# EAGLE design AB2KController (EAGLE 7.3.0)
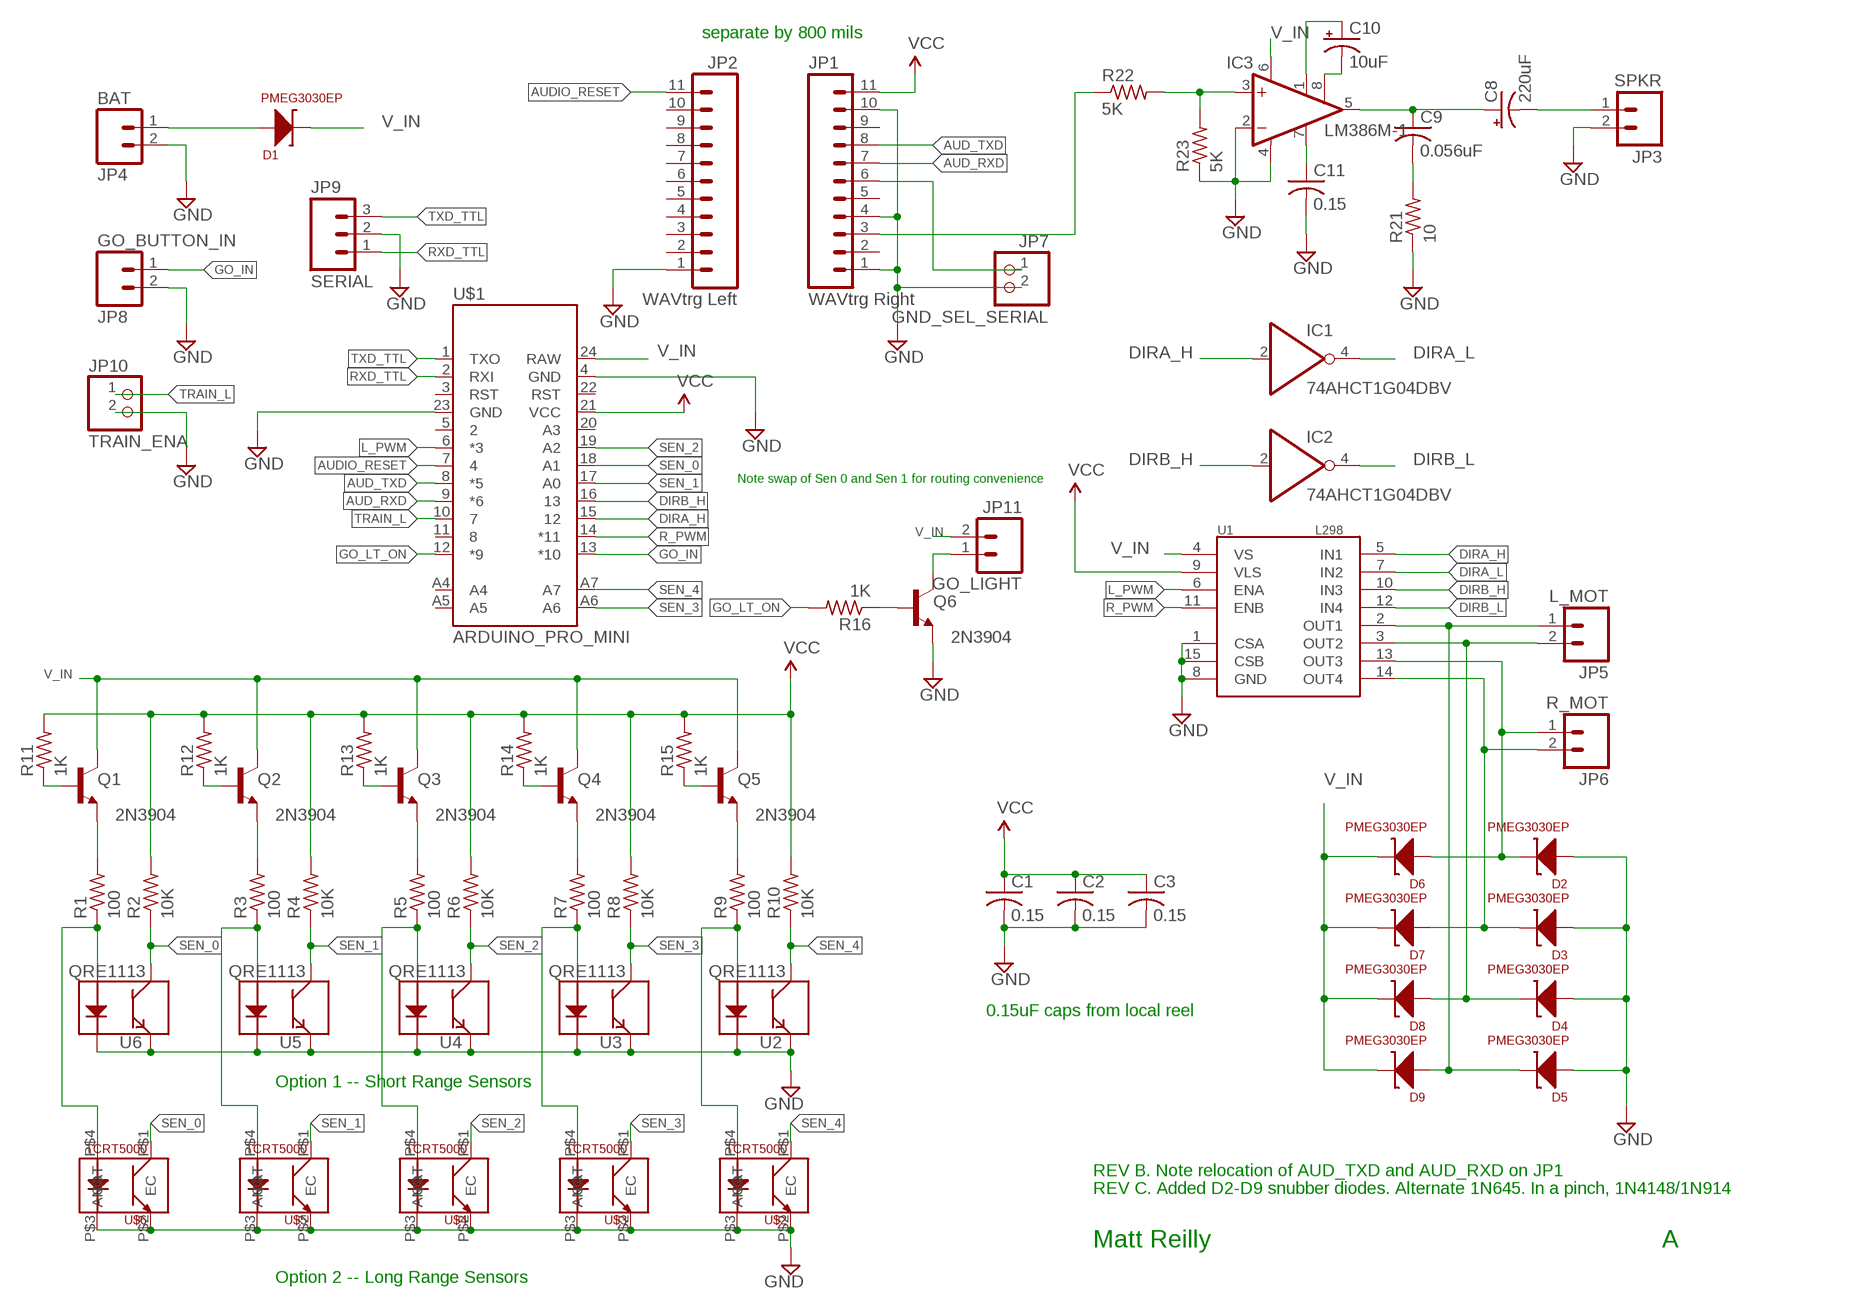
[diagram p0: schematic, sheet 1]

## Parts
C1  0.15  C-USC1206K  [C1206K]
C2  0.15  C-USC1206K  [C1206K]
C3  0.15  C-USC1206K  [C1206K]
C8  220uF  CPOL-USD/7343-31R  [D/7343-31R]
C9  0.056uF  C-USC1210  [C1210]
C10  10uF  CPOL-USD/7343-31R  [D/7343-31R]
C11  0.15  C-USC1206K  [C1206K]
D1  PMEG3030EP  [SOD128]
D2  PMEG3030EP  [SOD128]
D3  PMEG3030EP  [SOD128]
D4  PMEG3030EP  [SOD128]
D5  PMEG3030EP  [SOD128]
D6  PMEG3030EP  [SOD128]
D7  PMEG3030EP  [SOD128]
D8  PMEG3030EP  [SOD128]
D9  PMEG3030EP  [SOD128]
IC1  74AHCT1G04DBV  [SOT23-5]
IC2  74AHCT1G04DBV  [SOT23-5]
IC3  LM386M-1  [SO08]
JP1  WAVtrg Right  M11PTH  [1X11]
JP2  WAVtrg Left  M11PTH  [1X11]
JP3  SPKR  M025MM  [SCREWTERMINAL-5MM-2]
JP4  BAT  M025MM  [SCREWTERMINAL-5MM-2]
JP5  L_MOT  M025MM  [SCREWTERMINAL-5MM-2]
JP6  R_MOT  M025MM  [SCREWTERMINAL-5MM-2]
JP7  GND_SEL_SERIAL  PINHD-1X2  [1X02]
JP8  GO_BUTTON_IN  M025MM  [SCREWTERMINAL-5MM-2]
JP9  SERIAL  M03PTH  [1X03]
JP10  TRAIN_ENA  PINHD-1X2  [1X02]
JP11  GO_LIGHT  M025MM  [SCREWTERMINAL-5MM-2]
Q1  2N3904  [TO92]
Q2  2N3904  [TO92]
Q3  2N3904  [TO92]
Q4  2N3904  [TO92]
Q5  2N3904  [TO92]
Q6  2N3904  [TO92]
R1  100  R-US_M1206  [M1206]
R2  10K  R-US_M1206  [M1206]
R3  100  R-US_M1206  [M1206]
R4  10K  R-US_M1206  [M1206]
R5  100  R-US_M1206  [M1206]
R6  10K  R-US_M1206  [M1206]
R7  100  R-US_M1206  [M1206]
R8  10K  R-US_M1206  [M1206]
R9  100  R-US_M1206  [M1206]
R10  10K  R-US_M1206  [M1206]
R11  1K  R-US_M1206  [M1206]
R12  1K  R-US_M1206  [M1206]
R13  1K  R-US_M1206  [M1206]
R14  1K  R-US_M1206  [M1206]
R15  1K  R-US_M1206  [M1206]
R16  1K  R-US_M1206  [M1206]
R21  10  R-US_R1210  [R1210]
R22  5K  R-US_R1206  [R1206]
R23  5K  R-US_R1206  [R1206]
U1  L298  [MULTIWATT15]
U2  QRE1113  [QRE1113]
U3  QRE1113  [QRE1113]
U4  QRE1113  [QRE1113]
U5  QRE1113  [QRE1113]
U6  QRE1113  [QRE1113]
U$1  ARDUINO_PRO_MINI  [ARDUINO_PRO_MINI]
U$2  TCRT5000  [TCRT5000]
U$3  TCRT5000  [TCRT5000]
U$4  TCRT5000  [TCRT5000]
U$5  TCRT5000  [TCRT5000]
U$6  TCRT5000  [TCRT5000]

## Nets
AUD_RXD: JP1.7 U$1.9(*6)
AUD_TXD: JP1.8 U$1.8(*5)
AUDIO_RESET: JP2.11 U$1.7
DIRA_H: IC1.2(I) U1.5(IN1) U$1.15
DIRA_L: IC1.4(O) U1.7(IN2)
DIRB_H: IC2.2(I) U1.10(IN3) U$1.16
DIRB_L: IC2.4(O) U1.12(IN4)
GND: C1.2 C2.2 C3.2 C11.2 D2.P$1(A) D3.P$1(A) D4.P$1(A) D5.P$1(A) IC3.2(-IN) IC3.4(GND) JP1.1 JP1.4 JP1.10 JP2.1 JP3.2 JP4.2 JP7.2 JP8.2 JP9.2 JP10.2 Q6.3(E) R21.1 R23.1 U1.1(CSA) U1.8(GND) U1.15(CSB) U2.2(K) U2.4(E) U3.2(K) U3.4(E) U4.2(K) U4.4(E) U5.2(K) U5.4(E) U6.2(K) U6.4(E) U$1.4(GND) U$1.23(GND) U$2.P$2(E) U$2.P$3(CAT) U$3.P$2(E) U$3.P$3(CAT) U$4.P$2(E) U$4.P$3(CAT) U$5.P$2(E) U$5.P$3(CAT) U$6.P$2(E) U$6.P$3(CAT)
GO_IN: JP8.1 U$1.13(*10)
GO_LT_ON: R16.2 U$1.12(*9)
L_PWM: U1.6(ENA) U$1.6(*3)
N$1: D5.P$2(C) D9.P$1(A) JP5.1 U1.2(OUT1)
N$2: D4.P$2(C) D8.P$1(A) JP5.2 U1.3(OUT2)
N$3: D2.P$2(C) D6.P$1(A) JP6.1 U1.13(OUT3)
N$4: D3.P$2(C) D7.P$1(A) JP6.2 U1.14(OUT4)
N$5: D1.P$1(A) JP4.1
N$6: JP11.1 Q6.1(C)
N$7: R1.1 U6.1(A) U$6.P$4(ANO)
N$8: R3.1 U5.1(A) U$5.P$4(ANO)
N$9: Q1.3(E) R1.2
N$10: Q2.3(E) R3.2
N$11: R5.1 U4.1(A) U$4.P$4(ANO)
N$12: Q3.3(E) R5.2
N$13: R7.1 U3.1(A) U$3.P$4(ANO)
N$14: R9.1 U2.1(A) U$2.P$4(ANO)
N$15: Q1.2(B) R11.1
N$16: IC3.3(+IN) R22.2 R23.2
N$17: Q2.2(B) R12.1
N$18: C8.+ C9.1 IC3.5(OUT)
N$19: C8.- JP3.1
N$20: C10.- IC3.8(GAIN)
N$21: C9.2 R21.2
N$22: C10.+ IC3.1(GAIN)
N$23: C11.1 IC3.7(BYPASS)
N$24: Q3.2(B) R13.1
N$25: Q6.2(B) R16.1
N$26: Q4.2(B) R14.1
N$27: JP1.3 R22.1
N$28: JP1.6 JP7.1
N$29: Q5.2(B) R15.1
N$30: Q4.3(E) R7.2
N$31: Q5.3(E) R9.2
R_PWM: U1.11(ENB) U$1.14(*11)
RXD_TTL: JP9.1 U$1.2(RXI)
SEN_0: R2.1 U6.3(C) U$1.18(A1) U$6.P$1(C)
SEN_1: R4.1 U5.3(C) U$1.17(A0) U$5.P$1(C)
SEN_2: R6.1 U4.3(C) U$1.19(A2) U$4.P$1(C)
SEN_3: R8.1 U3.3(C) U$1.A6 U$3.P$1(C)
SEN_4: R10.1 U2.3(C) U$1.A7 U$2.P$1(C)
TRAIN_L: JP10.1 U$1.10
TXD_TTL: JP9.3 U$1.1(TXO)
V_IN: D1.P$2(C) D6.P$2(C) D7.P$2(C) D8.P$2(C) D9.P$2(C) IC3.6(VS) JP11.2 Q1.1(C) Q2.1(C) Q3.1(C) Q4.1(C) Q5.1(C) U1.4(VS) U$1.24(RAW)
VCC: C1.1 C2.1 C3.1 JP1.11 R2.2 R4.2 R6.2 R8.2 R10.2 R11.2 R12.2 R13.2 R14.2 R15.2 U1.9(VLS) U$1.21(VCC)
Unconnected: JP1.2 JP1.5 JP1.9 JP2.2 JP2.3 JP2.4 JP2.5 JP2.6 JP2.7 JP2.8 JP2.9 JP2.10 U$1.3(RST) U$1.5 U$1.11 U$1.20(A3) U$1.22(RST) U$1.A4 U$1.A5

## Notes on the sheet
- separate by 800 mils
- Note swap of Sen 0 and Sen 1 for routing convenience
- 0.15uF caps from local reel
- Option 1 -- Short Range Sensors
- REV B. Note relocation of AUD_TXD and AUD_RXD on JP1
- REV C. Added D2-D9 snubber diodes. Alternate 1N645. In a pinch, 1N4148/1N914
- Matt Reilly | A
- Option 2 -- Long Range Sensors

## Power pins joined to a net without a drawn wire
GND: IC1.3(GND) IC2.3(GND)
VCC: IC1.5(VCC) IC2.5(VCC)

## Library data of the parts
C1-C3 C11 = resistor:C-US: CAPACITOR, American symbol
C8 C10 = rcl:CPOL-US: POLARIZED CAPACITOR, American symbol
C9 = rcl:C-US: CAPACITOR, American symbol
D1-D9 = kb1vc_robot_parts:PMEG3030EP
IC1 IC2 = 74xx-little-de:74*1G04: INVERTER Gate
IC3 = linear:LM386?-*: Low Voltage Audio Power Amplifier Source: http://cache.national.com/ds/LM/LM386.pdf
JP1 JP2 = SparkFun-Connectors:M11: Header 11 Standard 11-pin 0.1" header. Use with straight break away headers (SKU : PRT-00116), right angle break away headers (PRT-00553), swiss pins (PRT-00743), machine pins (PRT-00117), and female headers (PRT-00115).
JP3-JP6 JP8 JP11 = SparkFun-Connectors:M02: Standard 2-pin 0.1" header. Use with - straight break away headers ( PRT-00116) - right angle break away headers (PRT-00553) - swiss pins (PRT-00743) - machine pins (PRT-00117) - female headers (PRT-00115) Molex polarized connector foot print use with: PRT-08233 with associated crimp pins and housings. 2.54_SCREWTERM for use with PRT-10571. 3.5mm Screw Terminal footprints for PRT-08084 5mm Screw Terminal footprints for use with PRT-08432; STOREFRONT_ID: PRT-08432
JP7 JP10 = pinhead:PINHD-1X2: PIN HEADER
JP9 = SparkFun-Connectors:M03: Header 3 Standard 3-pin 0.1" header. Use with straight break away headers (SKU : PRT-00116), right angle break away headers (PRT-00553), swiss pins (PRT-00743), machine pins (PRT-00117), and female headers (PRT-00115). Molex polarized connector foot print use with SKU : PRT-08232 with associated crimp pins and housings.
Q1-Q6 = transistor-npn:2N3904: NPN Transistor
R1-R16 = resistor:R-US_: RESISTOR, American symbol
R21-R23 = rcl:R-US_: RESISTOR, American symbol
U1 = SparkFun-PowerIC:L298: L298 Dual Full Bridge Driver
U2-U6 = SparkFun-Sensors:QRE1113: Reflective object sensor; PROD_ID: IC-09357
U$1 = kb1vc_Arduino_Parts:ARDUINO_PRO_MINI
U$2-U$6 = kb1vc_robot_parts:TCRT5000

## Board
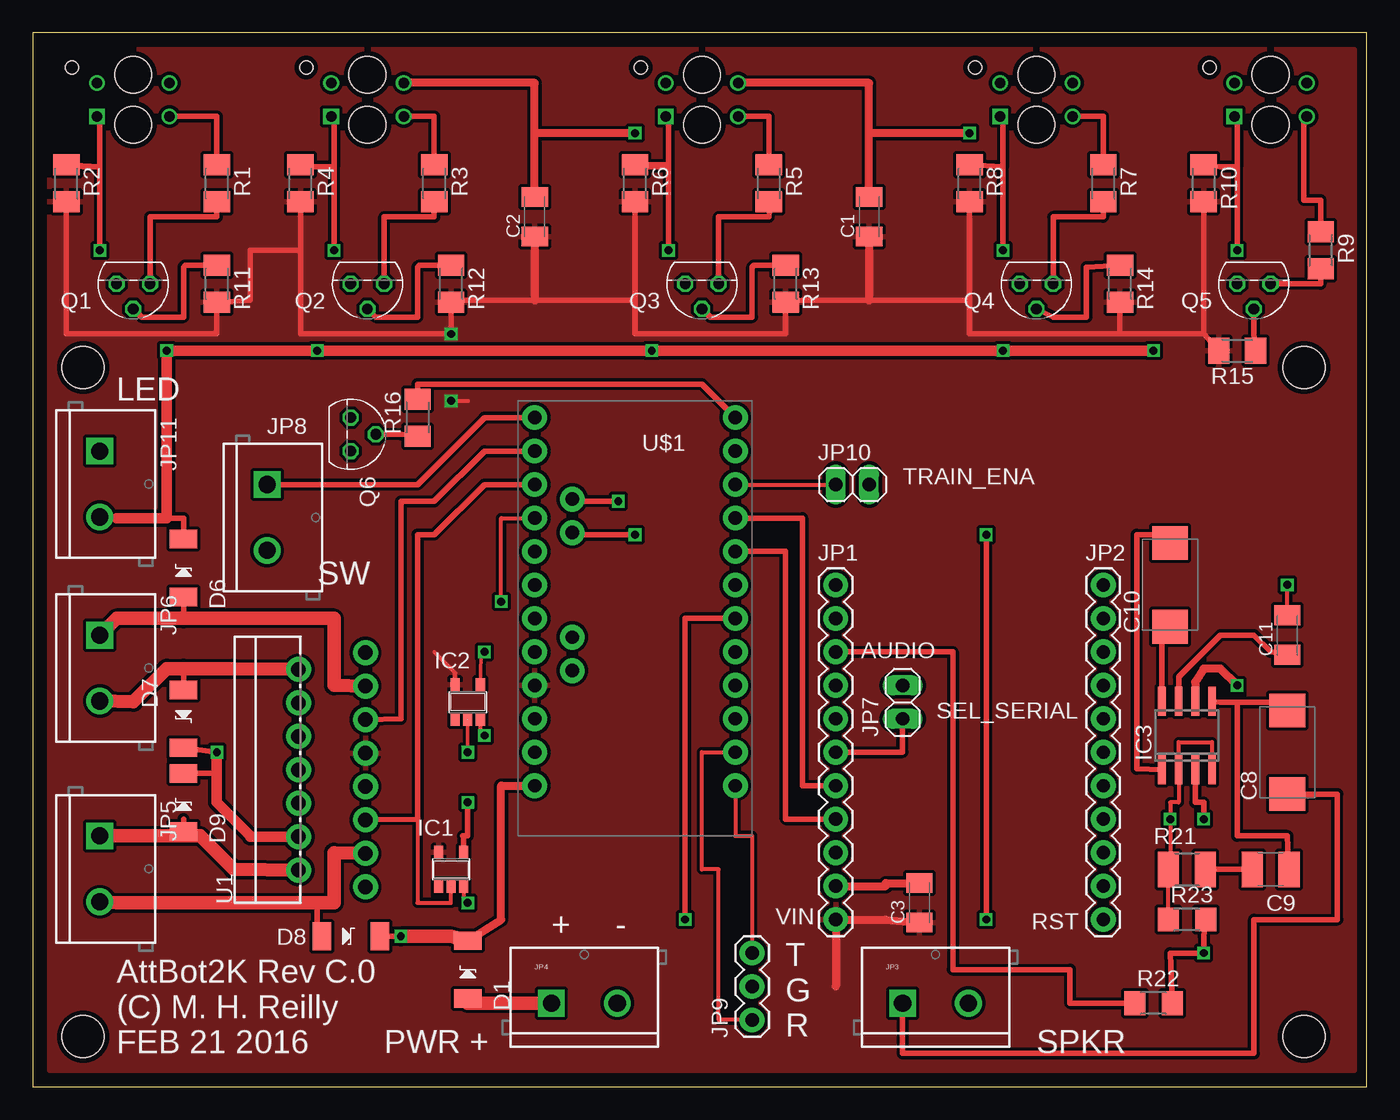
[diagram p1: board, top side]
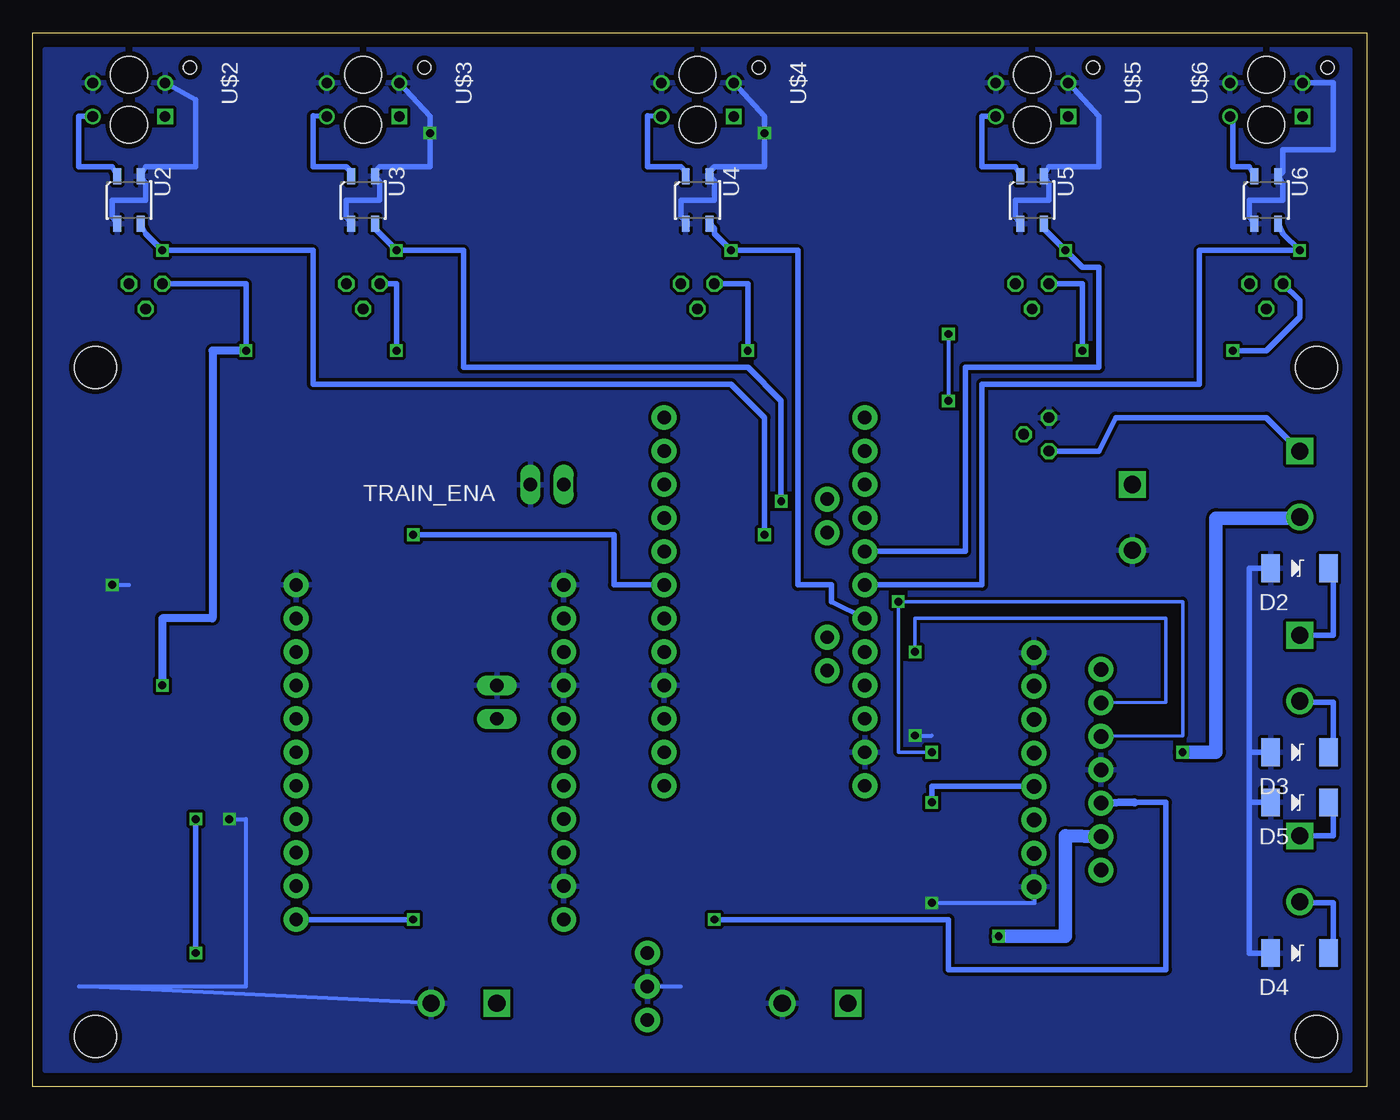
[diagram p2: board, bottom side, seen from below]

Size 101.27 x 80 mm. Coordinates in mm from the lower left corner, seen from the top.
Outline: 0,0 101.27,0 101.27,80 0,80 0,0
Copper layers (1*16): Top 0.0356mm / dielectric 1.5011mm / Bottom 0.0356mm
Design rules "oshpark-2layer": minimum track width 6mil, minimum drill 13mil, track to track 6mil, track to pad 6mil, pad to pad 6mil, via to via 6mil, smd to smd 6mil, copper to edge 15mil, drill to drill 6mil, minimum pad ring 7mil, minimum via ring 7mil, stop-mask expansion 2.5mil, vias tented up to drill 0mil, thermal gap 10mil
Holes 3.2 mm at 3.81,54.61 96.52,54.61 3.81,3.81 96.52,3.81

### Footprints (pad centres in the part's own frame; a part is rotated, then mirrored left to right if it is on the bottom)
C1206K = smd 1.5 x 2: 1 -1.5,0; 2 1.5,0
D/7343-31R = smd 2.55 x 2.7: + 3.175,0; - -3.175,0
C1210 = smd 1.6 x 2.7: 1 -1.4,0; 2 1.4,0
SOD128 = smd 1.4 x 2.1: P$1 -2.2,0; P$2 2.2,0
SOT23-5 = smd 0.69 x 0.99: 1 -0.95,-1.29; 2 0,-1.29; 3 0.95,-1.29; 4 0.95,1.3; 5 -0.95,1.3
SO08 = smd 0.6 x 2.2: 1 -1.905,-2.6; 2 -0.635,-2.6; 3 0.635,-2.6; 4 1.905,-2.6; 5 1.905,2.6; 6 0.635,2.6; 7 -0.635,2.6; 8 -1.905,2.6
1X11 = drill 1.016 pad 1.88: 1 0,0; 2 2.54,0; 3 5.08,0; 4 7.62,0; 5 10.16,0; 6 12.7,0; 7 15.24,0; 8 17.78,0; 9 20.32,0; 10 22.86,0; 11 25.4,0
SCREWTERMINAL-5MM-2 = drill 1.3 pad 2.032 square: 1 0,0 | drill 1.3 pad 2.032: 2 5,0
1X02 = drill 1.016 long: 1 -1.27,0; 2 1.27,0
1X03 = drill 1.016 pad 1.88: 1 0,0; 2 2.54,0; 3 5.08,0
TO92 = drill 0.813 octagon: 1 1.27,0; 2 0,1.905; 3 -1.27,0
M1206 = smd 1.6 x 2: 1 -1.4,0; 2 1.4,0
R1210 = smd 1.6 x 2.7: 1 -1.4,0; 2 1.4,0
R1206 = smd 1.6 x 1.803: 1 -1.422,0; 2 1.422,0
MULTIWATT15 = drill 1.1 pad 1.9: 1 -8.95,-2.39; 2 -7.68,2.69; 3 -6.41,-2.39; 4 -5.14,2.69; 5 -3.87,-2.39; 6 -2.6,2.69; 7 -1.33,-2.39; 8 -0.06,2.69; 9 1.21,-2.39; 10 2.48,2.69; 11 3.75,-2.39; 12 5.02,2.69; 13 6.29,-2.39; 14 7.56,2.69; 15 8.83,-2.39
QRE1113 = smd 1.2 x 0.6: 1 -1.8,-0.9; 2 1.8,-0.9; 3 1.8,0.9; 4 -1.8,0.9
ARDUINO_PRO_MINI = drill 1.016 pad 1.88: 1 -7.62,12.7; 2 -7.62,10.16; 3 -7.62,7.62; 4 -7.62,5.08; 5 -7.62,2.54; 6 -7.62,0; 7 -7.62,-2.54; 8 -7.62,-5.08; 9 -7.62,-7.62; 10 -7.62,-10.16; 11 -7.62,-12.7; 12 -7.62,-15.24; 13 7.62,-15.24; 14 7.62,-12.7; 15 7.62,-10.16; 16 7.62,-7.62; 17 7.62,-5.08; 18 7.62,-2.54; 19 7.62,0; 20 7.62,2.54; 21 7.62,5.08; 22 7.62,7.62; 23 7.62,10.16; 24 7.62,12.7; A4 4.763,1.429; A5 4.763,3.969; A6 4.763,-9.049; A7 4.763,-6.509
TCRT5000 = drill 0.8 square: P$1 -2.75,1.27 | drill 0.8: P$2 -2.75,-1.27; P$3 2.75,-1.27; P$4 2.75,1.27 | hole 1: -4.65,-2.45 | hole 2.8: 0,-1.9; 0,1.9

### Placement (x,y rotation side)
C1  63.5,66.04 90 top
C2  38.1,66.04 90 top
C3  67.31,13.97 90 top
C8  95.25,25.4 90 top
C9  93.98,16.51 180 top
C10  86.36,38.1 90 top
C11  95.25,34.29 90 top
D1  33.02,8.89 90 top
D2  5.08,39.37 0 bottom
D3  5.08,25.4 0 bottom
D4  5.08,10.16 0 bottom
D5  5.08,21.59 0 bottom
D6  11.43,39.37 90 top
D7  11.43,27.94 270 top
D8  24.13,11.43 0 top
D9  11.43,21.59 90 top
IC1  31.75,16.51 0 top
IC2  33.02,29.21 0 top
IC3  87.63,26.67 0 top
JP1  60.96,38.1 270 top
JP2  81.28,38.1 270 top
JP3  66.04,6.35 0 top
JP4  39.37,6.35 0 top
JP5  5.08,19.05 270 top
JP6  5.08,34.29 270 top
JP7  66.04,29.21 90 top
JP8  17.78,45.72 270 top
JP9  54.61,5.08 90 top
JP10  62.23,45.72 0 top
JP11  5.08,48.26 270 top
Q1  7.62,60.96 180 top
Q2  25.4,60.96 180 top
Q3  50.8,60.96 180 top
Q4  76.2,60.96 180 top
Q5  92.71,60.96 180 top
Q6  24.13,49.53 270 top
R1  13.97,68.58 270 top
R2  2.54,68.58 270 top
R3  30.48,68.58 270 top
R4  20.32,68.58 270 top
R5  55.88,68.58 270 top
R6  45.72,68.58 270 top
R7  81.28,68.58 270 top
R8  71.12,68.58 270 top
R9  97.79,63.5 270 top
R10  88.9,68.58 270 top
R11  13.97,60.96 270 top
R12  31.75,60.96 270 top
R13  57.15,60.96 270 top
R14  82.55,60.96 270 top
R15  91.44,55.88 180 top
R16  29.21,50.8 90 top
R21  87.63,16.51 0 top
R22  85.09,6.35 0 top
R23  87.63,12.7 0 top
U1  22.86,24.13 90 top
U2  93.98,67.31 270 bottom
U3  76.2,67.31 270 bottom
U4  50.8,67.31 270 bottom
U5  25.4,67.31 270 bottom
U6  7.62,67.31 270 bottom
U$1  45.72,35.56 180 top
U$2  93.98,74.93 180 bottom
U$3  76.2,74.93 180 bottom
U$4  50.8,74.93 180 bottom
U$5  25.4,74.93 180 bottom
U$6  7.62,74.93 180 bottom

### Tracks (layer width: path | path; a pad name or v marks a point on that pad's centre or on a via)
AUD_RXD
  Top 0.406: U$1.9 58.42,43.18 58.42,22.86 JP1.7
AUD_TXD
  Top 0.406: U$1.8 57.15,40.64 57.15,20.32 JP1.8
AUDIO_RESET  (via drill 0.6)
  Top 0.406: v72.39,12.7 v72.39,41.91
  Bottom 0.406: JP2.11 v72.39,12.7 | v72.39,41.91 57.15,41.91 57.15,38.1 U$1.7
DIRA_H
  Top 0.305: 29.21,20.32 29.21,13.97 31.75,13.97 IC1.2
  Top 0.406: U$1.15 34.29,45.72 30.48,41.91 29.21,41.91 29.21,20.32 U1.5
DIRA_L  (via drill 0.6)
  Top 0.406: v33.02,21.59 33.02,19.05 32.7,19.05 | 32.64,19.05 32.7,19.05 | 32.7,19.05 IC1.4
  Bottom 0.406: U1.7 33.02,22.8 v33.02,21.59
DIRB_H  (via drill 0.6)
  Top 0.254: IC2.2 v33.02,25.4
  Top 0.305: v35.56,36.83 35.56,43.18 U$1.16
  Bottom 0.254: v33.02,25.4 35.56,25.4 v35.56,36.83 13.97,36.83 13.97,26.67 U1.10
DIRB_L  (via drill 0.6)
  Top 0.254: v34.29,33.02 34.04,32.64 IC2.4
  Bottom 0.254: U1.12 15.24,29.21 15.24,35.56 34.29,35.56 v34.29,33.02
GND  (via drill 0.6)
  Top 0.305: IC3.4 89.53,26.16 87,26.16 IC3.2 87,21.59 86.36,21.59 v86.36,20.32 86.36,17.78 R21.1 R23.1 | IC1.3 32.7,14.29 v33.02,13.97 | IC2.3 33.97,26.99 v34.29,26.67 | C11.2 v95.25,38.1
  Top 0.61: C2.2 38.1,72.39 | v45.72,72.39 38.1,72.39 | 38.1,72.39 38.1,76.2 U$5.P$3 | C1.2 63.5,72.39 | v71.12,72.39 63.5,72.39 | JP1.10 64.77,15.24 64.77,15.47 C3.2 | 63.5,72.39 63.5,76.2 U$4.P$3
  Bottom 0.305: JP3.2 97.79,7.62 85.09,7.62 85.09,20.32 v86.36,20.32 | v33.02,13.97 25.19,13.97 U1.1 | v34.29,26.67 33.02,26.67 | v95.25,38.1 93.98,38.1 | JP9.2 52.07,7.62
  Bottom 0.406: U6.2 8.89,66.04 8.89,67.31 6.35,67.31 6.35,68.58 U6.4 6.35,69.48 6.35,71.12 2.54,71.12 2.54,76.2 U$6.P$2 | U$5.P$2 20.32,73.66 20.32,69.85 24.13,69.85 U5.4 24.13,68.58 24.13,67.31 26.67,67.31 26.67,66.04 U5.2 | U$4.P$2 45.72,73.66 v45.72,72.39 45.72,69.85 49.53,69.85 49.9,69.48 U4.4 49.53,68.74 49.53,67.31 52.07,67.31 52.07,66.04 51.7,65.67 U4.2 | U3.2 77.1,65.67 77.47,66.04 77.47,67.31 74.93,67.31 74.93,68.74 U3.4 75.3,69.48 74.93,69.85 71.12,69.85 v71.12,72.39 71.12,73.66 U$3.P$2 | U$2.P$2 88.9,74.93 88.9,69.85 92.71,69.85 U2.4 92.71,68.58 92.71,67.31 95.25,67.31 95.25,66.04 U2.2 | D4.P$1 8.89,10.16 8.89,21.59 | 8.89,21.59 D5.P$1 | 8.89,21.59 8.89,25.4 | 8.89,25.4 D3.P$1 | 8.89,25.4 8.89,39.37 D2.P$1
  pour Bottom (isolate 0.254): 1.27,78.74 1.27,1.27 100.33,1.27 100.33,78.74
GO_IN
  Top 0.406: U$1.13 34.29,50.8 29.21,45.72 JP8.1
GO_LT_ON
  Top 0.406: U$1.12 50.8,53.34 29.21,53.34 R16.2
L_PWM  (via drill 0.6)
  Top 0.406: U$1.6 49.53,35.56 v49.53,12.7
  Bottom 0.406: v49.53,12.7 31.75,12.7 31.75,8.89 15.24,8.89 15.24,21.59 17.63,21.59
  Bottom 0.61: 17.63,21.59 U1.6
N$1
  Top 0.406: 11.43,20.32 D9.P$1 11.43,19.05
  Top 1.016: JP5.1 11.43,19.05 12.7,19.05 15.24,16.51 U1.2
  Bottom 0.406: D5.P$2 2.54,21.59 2.54,19.05 JP5.1
N$2
  Top 0.406: D8.P$1 21.59,11.43 21.59,13.97
  Top 1.016: JP5.2 6.35,13.97 21.59,13.97 22.86,13.97 22.86,17.78 U1.3
  Bottom 0.406: D4.P$2 2.54,10.16 2.54,13.97 5.08,13.97 JP5.2
N$3
  Top 0.406: D6.P$1 11.43,35.56
  Top 1.016: U1.13 22.86,30.48 22.86,35.56 11.43,35.56 6.35,35.56 JP6.1
  Bottom 0.406: D2.P$2 2.54,39.37 2.54,34.29 JP6.1
N$4
  Top 0.406: D7.P$1 | D7.P$1 11.43,31.75
  Top 1.016: JP6.2 7.62,29.22 10.16,31.75 11.43,31.75 15.24,31.75 U1.14
  Bottom 0.406: D3.P$2 2.54,25.4 2.54,29.21 5.08,29.21 JP6.2
N$5
  Top 1.016: JP4.1 33.02,6.35 D1.P$1
N$6
  Bottom 0.406: Q6.1 20.32,48.26 19.05,50.8 7.62,50.8 JP11.1
N$7
  Top 0.406: U$6.P$4 13.97,73.66 R1.1
  Bottom 0.406: U6.1 8.89,69.85 10.16,69.85 10.16,73.66 U$6.P$4
N$8
  Top 0.406: U$5.P$4 30.48,73.66 R3.1
  Bottom 0.406: U5.1 26.67,69.85 29.21,69.85 29.21,73.66 U$5.P$4
N$9
  Top 0.406: Q1.3 8.89,66.04 13.97,66.04 R1.2
N$10
  Top 0.406: Q2.3 26.67,66.04 30.48,66.04 R3.2
N$11
  Top 0.406: R5.1 55.88,73.66 U$4.P$4
  Bottom 0.406: U4.1 51.7,69.48 52.07,69.85 54.61,69.85 54.61,73.7 U$4.P$4
N$12
  Top 0.406: Q3.3 52.07,66.04 55.88,66.04 56.01,67.18 R5.2
N$13
  Top 0.406: R7.1 81.28,73.66 U$3.P$4
  Bottom 0.406: U3.1 77.1,69.48 77.47,69.85 80.01,69.85 80.01,73.7 U$3.P$4
N$14
  Top 0.406: R9.1 97.79,67.31 96.52,67.31 96.52,73.66 U$2.P$4
  Bottom 0.406: U2.1 95.25,69.85 97.79,69.85 97.79,73.66 U$2.P$4
N$15
  Top 0.406: Q1.2 8.26,58.42 11.43,58.42 11.43,62.23 11.56,62.36 R11.1
N$16  (via drill 0.6)
  Top 0.406: R22.2 86.36,10.16 v88.9,10.16 88.9,11.43 R23.2 | IC3.3 88.27,21.59 88.9,21.59 v88.9,20.32
  Bottom 0.406: v88.9,10.16 v88.9,20.32
N$17
  Top 0.406: Q2.2 26.04,58.42 29.21,58.42 29.21,62.23 29.34,62.36 R12.1
N$18
  Top 0.406: C9.1 95.25,19.05 91.44,19.05 91.44,29.21 | 91.44,29.21 90.17,29.21 IC3.5 | 91.44,29.21 95.25,29.21 C8.+
N$19
  Top 0.406: JP3.1 66.04,2.54 92.71,2.54 92.71,12.7 99.06,12.7 99.06,22.23 C8.-
N$20
  Top 0.406: C10.- 85.72,33.91 IC3.8
N$21
  Top 0.406: R21.2 C9.2
N$22
  Top 0.406: IC3.1 83.82,24.13 83.82,41.91 86.36,41.91 C10.+
N$23
  Top 0.406: C11.1 93.98,33.02 92.71,34.29 90.17,34.29 87,31.11 IC3.7
N$24
  Top 0.406: Q3.2 51.44,58.42 54.61,58.42 54.61,62.23 54.74,62.36 R13.1
N$25
  Top 0.406: R16.1 27.94,49.53 Q6.2
N$26
  Top 0.406: R14.1 80.01,62.23 80.01,58.42 77.47,58.42 Q4.2
N$27
  Top 0.406: JP1.3 69.85,33.02 69.85,8.89 78.74,8.89 78.74,6.35 R22.1
N$28
  Top 0.406: JP1.6 66.04,25.4 JP7.1
N$29
  Top 0.406: Q5.2 92.71,57.15 R15.1
N$30
  Top 0.406: R7.2 81.28,66.04 77.47,66.04 Q4.3
N$31
  Top 0.406: R9.2 97.79,60.96 Q5.3
R_PWM
  Top 0.406: U1.11 27.94,27.94 27.94,44.45 30.48,44.45 34.29,48.26 U$1.14
RXD_TTL
  Top 0.305: JP9.1 52.07,5.08 52.07,16.51 50.8,16.51 50.8,25.4 U$1.2
SEN_0  (via drill 0.6)
  Top 0.406: U$6.P$1 5.08,73.66 5.08,69.85 | 5.08,69.85 3.81,69.85 R2.1 5.08,69.85 | 5.08,69.85 v5.08,63.5
  Bottom 0.406: U6.3 6.35,64.77 v5.08,63.5 12.7,63.5 12.7,53.34 29.21,53.34 29.21,38.1 U$1.18
SEN_1  (via drill 0.6)
  Top 0.406: U$5.P$1 22.86,73.66 22.86,69.85 | 22.86,69.85 20.45,69.85 R4.1 | v22.86,63.5 22.86,69.85
  Bottom 0.406: U5.3 24.5,65.14 v22.86,63.5 21.59,62.23 20.32,62.23 20.32,54.61 30.48,54.61 30.48,40.64 U$1.17
SEN_2  (via drill 0.6)
  Top 0.406: U$4.P$1 48.26,73.66 48.26,69.85 | 48.26,69.85 45.85,69.85 R6.1 48.13,69.98 48.26,69.85 | 48.26,69.85 v48.26,63.5
  Bottom 0.406: U4.3 49.53,65.14 49.53,64.77 v48.26,63.5 43.18,63.5 43.18,38.1 40.64,38.1 40.64,36.83 U$1.19
SEN_3  (via drill 0.6)
  Top 0.406: v73.66,63.5 73.66,69.85 | 73.66,69.85 R8.1 | U$3.P$1 73.66,73.66 73.66,69.85 | v44.45,44.45 40.64,44.45 U$1.A6
  Bottom 0.406: U3.3 75.3,65.14 v73.66,63.5 68.58,63.5 68.58,54.61 46.99,54.61 44.45,52.07 v44.45,44.45
SEN_4  (via drill 0.6)
  Top 0.406: U$2.P$1 91.44,73.66 91.44,69.85 | 91.44,69.85 90.17,69.85 R10.1 | v91.44,63.5 91.44,69.85 | U$1.A7 40.64,41.91 v45.72,41.91
  Bottom 0.406: U2.3 92.71,64.77 v91.44,63.5 80.01,63.5 80.01,53.34 48.26,53.34 45.72,50.8 v45.72,41.91
TRAIN_L
  Top 0.305: U$1.10 JP10.1
TXD_TTL
  Top 0.305: U$1.1 53.34,19.05 54.61,19.05 JP9.3
V_IN  (via drill 0.6)
  Top 0.406: JP11.2 6.35,43.18 | D6.P$2 11.43,43.18 10.16,43.18 | D7.P$2 v13.97,25.4 | D9.P$2 13.97,23.79 13.97,24.13 | D8.P$2 v27.94,11.43
  Top 0.61: D1.P$2 35.56,12.7 35.56,22.86 U$1.24 | v91.44,30.48 90.17,31.75 88.9,31.75 88.27,30.73 IC3.6
  Top 0.813: 6.35,43.18 10.16,43.18 v10.16,55.88 v21.59,55.88 v46.99,55.88 v73.66,55.88 v85.09,55.88 | U1.4 16.51,18.99 16.51,19.05 13.97,21.59 13.97,24.13 v13.97,25.4
  Top 1.016: D1.P$2 31.75,11.43 v27.94,11.43
  Bottom 0.406: v73.66,55.88 73.66,60.96 Q4.1 | v85.09,55.88 85.09,60.96 Q5.1 | v10.16,55.88 7.62,55.88 5.08,58.42 5.08,59.69 Q1.1 | Q2.1 21.59,60.96 v21.59,55.88 | Q3.1 46.99,60.96 v46.99,55.88
  Bottom 0.61: v85.09,55.88 87.63,55.88 87.63,35.56 91.44,35.56 v91.44,30.48
  Bottom 0.813: 5.16,43.18 JP11.2
  Bottom 1.016: v27.94,11.43 22.86,11.43 22.86,19.05 U1.4 | v13.97,25.4 11.43,25.4 11.43,43.18 5.16,43.18
VCC  (via drill 0.6)
  Top 0.305: IC2.5 32.07,31.43 30.48,33.02 | v31.75,52.07 33.02,52.07
  Top 0.406: R2.2 2.54,57.15 13.97,57.15 R11.2 16.51,59.69 16.51,63.5 20.32,63.5 | R6.2 45.72,59.69 | 45.72,59.69 45.72,57.15 57.15,57.15 R13.2 58.42,59.69 63.5,59.69 71.12,59.69 | 45.72,59.69 38.1,59.69 31.88,59.69 R12.2 v31.75,57.15 20.32,57.15 20.32,63.5 | R8.2 71.12,59.69 | R14.2 82.55,57.15 | 82.55,57.15 71.12,57.15 71.12,59.69 | R15.2 88.9,57.15 | 88.9,57.15 82.55,57.15 | R10.2 88.9,57.15 | 20.32,63.5 R4.2
  Top 0.61: C2.1 38.1,59.69 | C1.1 63.5,59.69 | C3.1 64.77,12.7 JP1.11 60.96,7.62
  Bottom 0.305: v31.75,57.15 v31.75,52.07
  pour Top (isolate 0.254): 1.27,78.74 100.33,78.74 100.33,1.27 1.27,1.27

### Text on the board
tPlace: LED | TRAIN_ENA | SW | AUDIO | SEL_SERIAL | VIN | RST | + - | T / G / R | AttBot2K Rev C.0 / (C) M. H. Reilly / FEB 21 2016 | PWR + | SPKR
bPlace: TRAIN_ENA